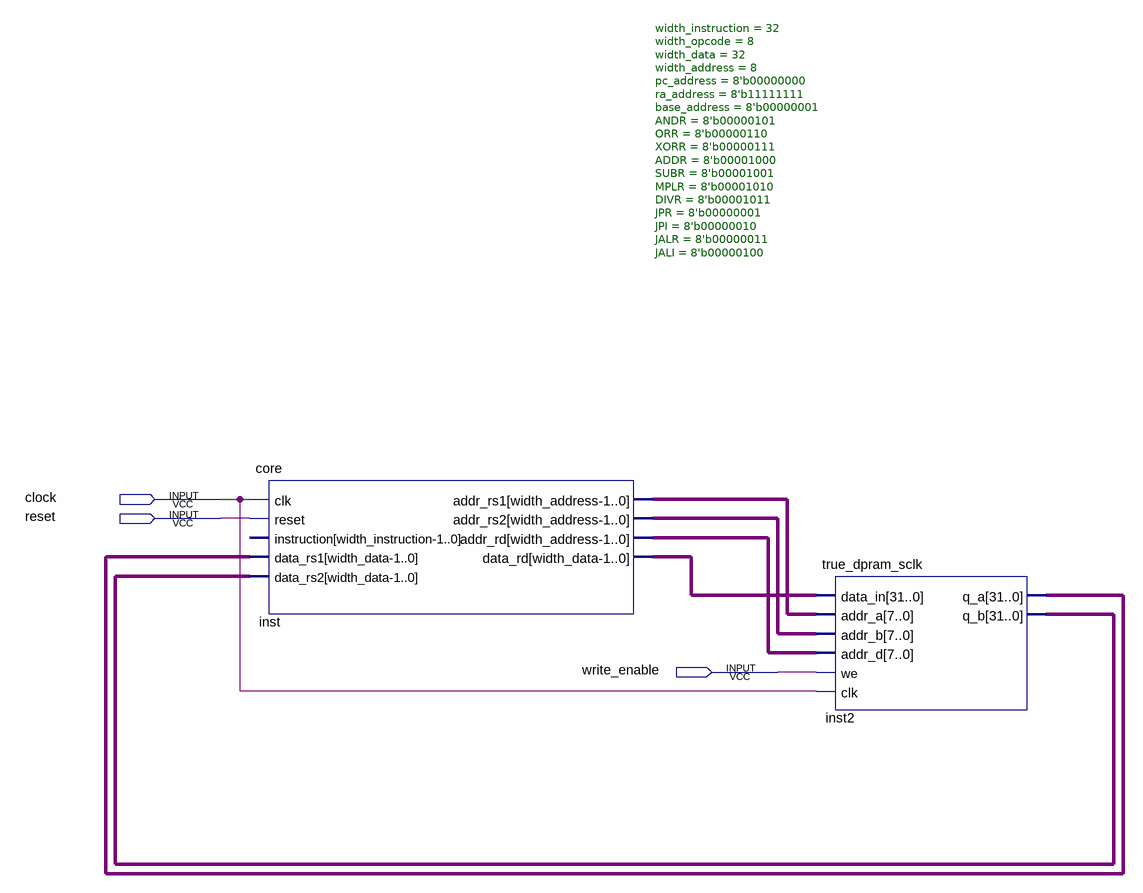
[diagram p0: schematic sheet]
// Quartus schematic omproc1.bdf as structural Verilog: 2 symbols, 3 pins
module omproc1 (
  input  clock,
  input  reset,
  input  write_enable
);

  wire [7:0] inst_addr_rd, inst_addr_rs1, inst_addr_rs2;
  wire [31:0] inst2_q_a, inst2_q_b, inst_data_rd;

  core #(.width_instruction(32), .width_opcode(8), .width_data(32), .width_address(8), .pc_address(8'b00000000), .ra_address(8'b11111111), .base_address(8'b00000001), .ANDR(8'b00000101), .ORR(8'b00000110), .XORR(8'b00000111), .ADDR(8'b00001000), .SUBR(8'b00001001), .MPLR(8'b00001010), .DIVR(8'b00001011), .JPR(8'b00000001), .JPI(8'b00000010), .JALR(8'b00000011), .JALI(8'b00000100)) inst (
    .clk(clock), .reset(reset), .data_rs1(inst2_q_a), .data_rs2(inst2_q_b), .addr_rs1(inst_addr_rs1),
    .addr_rs2(inst_addr_rs2), .addr_rd(inst_addr_rd), .data_rd(inst_data_rd));  // open: instruction
  true_dpram_sclk inst2 (
    .data_in(inst_data_rd), .addr_a(inst_addr_rs1), .addr_b(inst_addr_rs2), .addr_d(inst_addr_rd),
    .we(write_enable), .clk(clock), .q_a(inst2_q_a), .q_b(inst2_q_b));
endmodule
